# Altium schematic sheet EMP_FC_Main.SchDoc
size A4; SheetNumber: 1; SheetTotal: 5
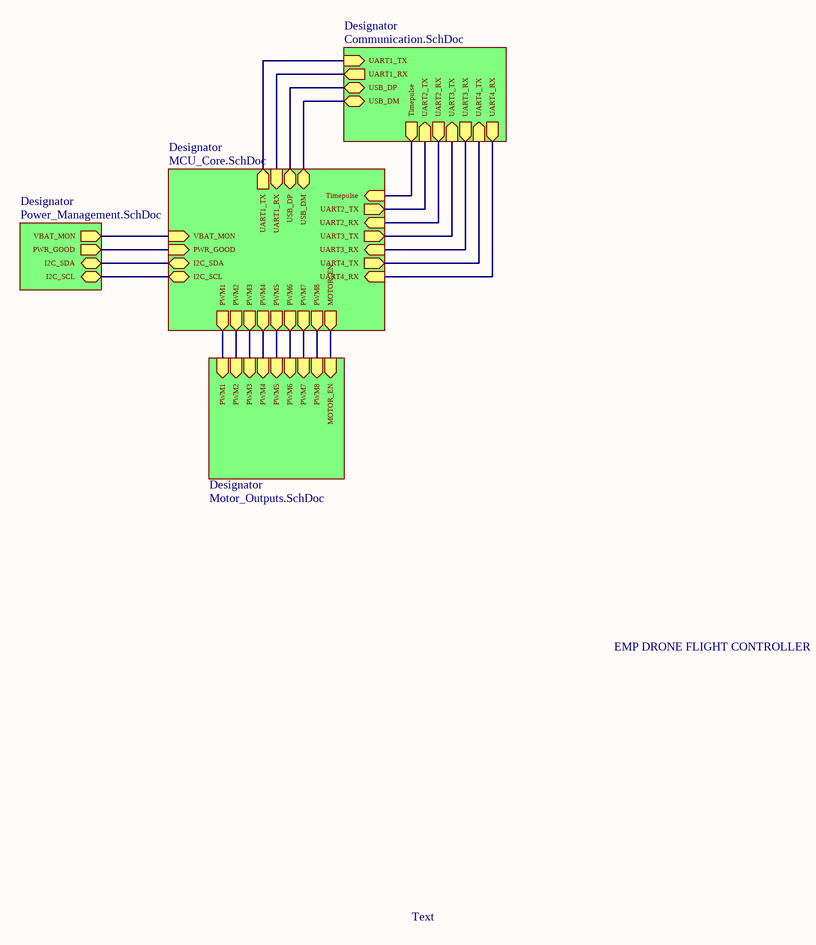
[diagram p0: EMP_FC_Main.SchDoc]

## Sub-sheets
Designator = Power_Management.SchDoc: VBAT_MON (out), PWR_GOOD (out), I2C_SDA (bidir), I2C_SCL (bidir)
Designator = MCU_Core.SchDoc: UART1_TX (out), UART1_RX (in), USB_DM (bidir), USB_DP (bidir), PWM5 (out), PWM4 (out), PWM3 (out), PWM2 (out), PWM1 (out), PWM6 (out), PWM7 (out), PWM8 (out), VBAT_MON (in), PWR_GOOD (in), MOTOR_EN (out), UART2_TX (out), UART3_TX (out), UART4_TX (out), UART2_RX (in), UART3_RX (in), UART4_RX (in), Timepulse (in), I2C_SDA (bidir), I2C_SCL (bidir)
Designator = Communication.SchDoc: UART1_TX (in), UART1_RX (out), USB_DP (bidir), USB_DM (bidir), UART2_RX (out), UART3_RX (out), UART4_RX (out), UART2_TX (in), UART3_TX (in), UART4_TX (in), Timepulse (out)
Designator = Motor_Outputs.SchDoc: PWM1 (in), PWM2 (in), PWM3 (in), PWM4 (in), PWM5 (in), MOTOR_EN (in), PWM6 (in), PWM7 (in), PWM8 (in)

## Nets
(unnamed): sheet Designator/VBAT_MON, sheet Designator/VBAT_MON
(unnamed): sheet Designator/PWR_GOOD, sheet Designator/PWR_GOOD
(unnamed): sheet Designator/I2C_SDA, sheet Designator/I2C_SDA
(unnamed): sheet Designator/I2C_SCL, sheet Designator/I2C_SCL
(unnamed): sheet Designator/UART1_TX, sheet Designator/UART1_TX
(unnamed): sheet Designator/UART1_RX, sheet Designator/UART1_RX
(unnamed): sheet Designator/USB_DM, sheet Designator/USB_DM
(unnamed): sheet Designator/USB_DP, sheet Designator/USB_DP
(unnamed): sheet Designator/PWM5, sheet Designator/PWM5
(unnamed): sheet Designator/PWM4, sheet Designator/PWM4
(unnamed): sheet Designator/PWM3, sheet Designator/PWM3
(unnamed): sheet Designator/PWM2, sheet Designator/PWM2
(unnamed): sheet Designator/PWM1, sheet Designator/PWM1
(unnamed): sheet Designator/PWM6, sheet Designator/PWM6
(unnamed): sheet Designator/PWM7, sheet Designator/PWM7
(unnamed): sheet Designator/PWM8, sheet Designator/PWM8
(unnamed): sheet Designator/MOTOR_EN, sheet Designator/MOTOR_EN
(unnamed): sheet Designator/UART2_TX, sheet Designator/UART2_TX
(unnamed): sheet Designator/UART3_TX, sheet Designator/UART3_TX
(unnamed): sheet Designator/UART4_TX, sheet Designator/UART4_TX
(unnamed): sheet Designator/UART2_RX, sheet Designator/UART2_RX
(unnamed): sheet Designator/UART3_RX, sheet Designator/UART3_RX
(unnamed): sheet Designator/UART4_RX, sheet Designator/UART4_RX
(unnamed): sheet Designator/Timepulse, sheet Designator/Timepulse

## Notes on the sheet
- EMP DRONE FLIGHT CONTROLLER
- Text